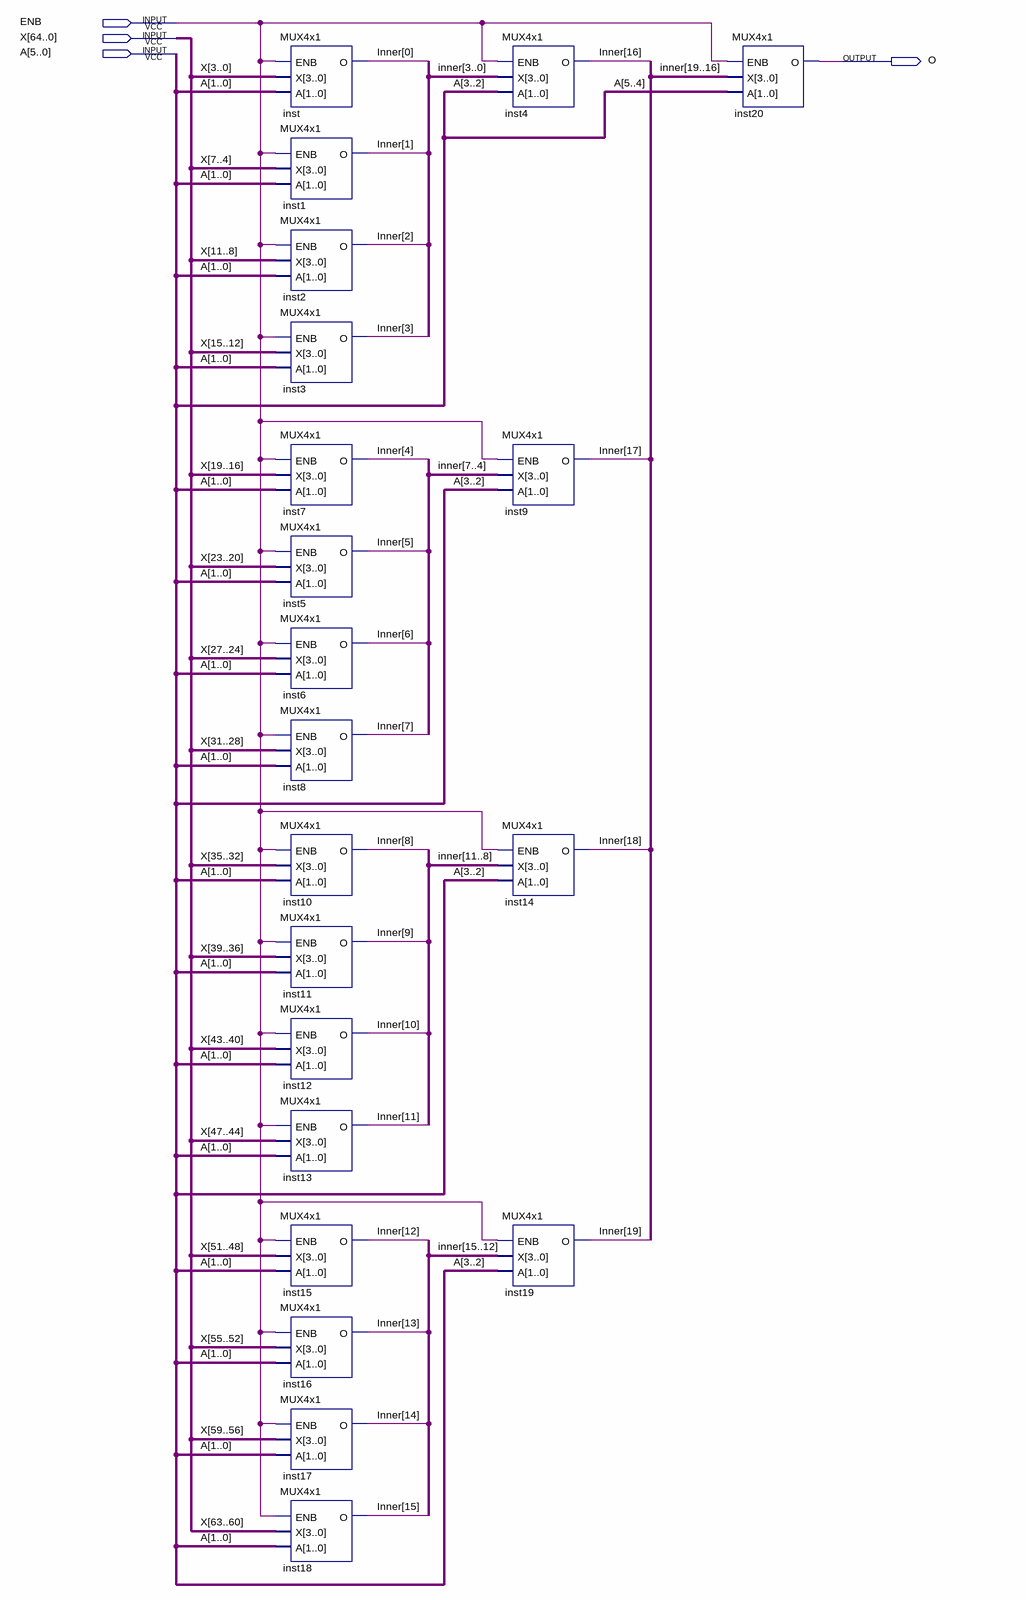
[diagram p0: schematic sheet]
// Quartus schematic MUX64x1.bdf as structural Verilog: 21 symbols, 4 pins
module MUX64x1 (
  input  ENB,
  input  [64:0] X,
  input  [5:0] A,
  output O
);

  wire [19:0] Inner;

  MUX4x1 inst (.ENB(ENB), .X(X[3:0]), .A(A[1:0]), .O(Inner[0]));
  MUX4x1 inst1 (.ENB(ENB), .X(X[7:4]), .A(A[1:0]), .O(Inner[1]));
  MUX4x1 inst2 (.ENB(ENB), .X(X[11:8]), .A(A[1:0]), .O(Inner[2]));
  MUX4x1 inst3 (.ENB(ENB), .X(X[15:12]), .A(A[1:0]), .O(Inner[3]));
  MUX4x1 inst7 (.ENB(ENB), .X(X[19:16]), .A(A[1:0]), .O(Inner[4]));
  MUX4x1 inst5 (.ENB(ENB), .X(X[23:20]), .A(A[1:0]), .O(Inner[5]));
  MUX4x1 inst6 (.ENB(ENB), .X(X[27:24]), .A(A[1:0]), .O(Inner[6]));
  MUX4x1 inst8 (.ENB(ENB), .X(X[31:28]), .A(A[1:0]), .O(Inner[7]));
  MUX4x1 inst10 (.ENB(ENB), .X(X[35:32]), .A(A[1:0]), .O(Inner[8]));
  MUX4x1 inst11 (.ENB(ENB), .X(X[39:36]), .A(A[1:0]), .O(Inner[9]));
  MUX4x1 inst12 (.ENB(ENB), .X(X[43:40]), .A(A[1:0]), .O(Inner[10]));
  MUX4x1 inst13 (.ENB(ENB), .X(X[47:44]), .A(A[1:0]), .O(Inner[11]));
  MUX4x1 inst15 (.ENB(ENB), .X(X[51:48]), .A(A[1:0]), .O(Inner[12]));
  MUX4x1 inst16 (.ENB(ENB), .X(X[55:52]), .A(A[1:0]), .O(Inner[13]));
  MUX4x1 inst17 (.ENB(ENB), .X(X[59:56]), .A(A[1:0]), .O(Inner[14]));
  MUX4x1 inst18 (.ENB(ENB), .X(X[63:60]), .A(A[1:0]), .O(Inner[15]));
  MUX4x1 inst4 (.ENB(ENB), .X(Inner[3:0]), .A(A[3:2]), .O(Inner[16]));
  MUX4x1 inst9 (.ENB(ENB), .X(Inner[7:4]), .A(A[3:2]), .O(Inner[17]));
  MUX4x1 inst14 (.ENB(ENB), .X(Inner[11:8]), .A(A[3:2]), .O(Inner[18]));
  MUX4x1 inst19 (.ENB(ENB), .X(Inner[15:12]), .A(A[3:2]), .O(Inner[19]));
  MUX4x1 inst20 (.ENB(ENB), .X(Inner[19:16]), .A(A[5:4]), .O(O));
endmodule
